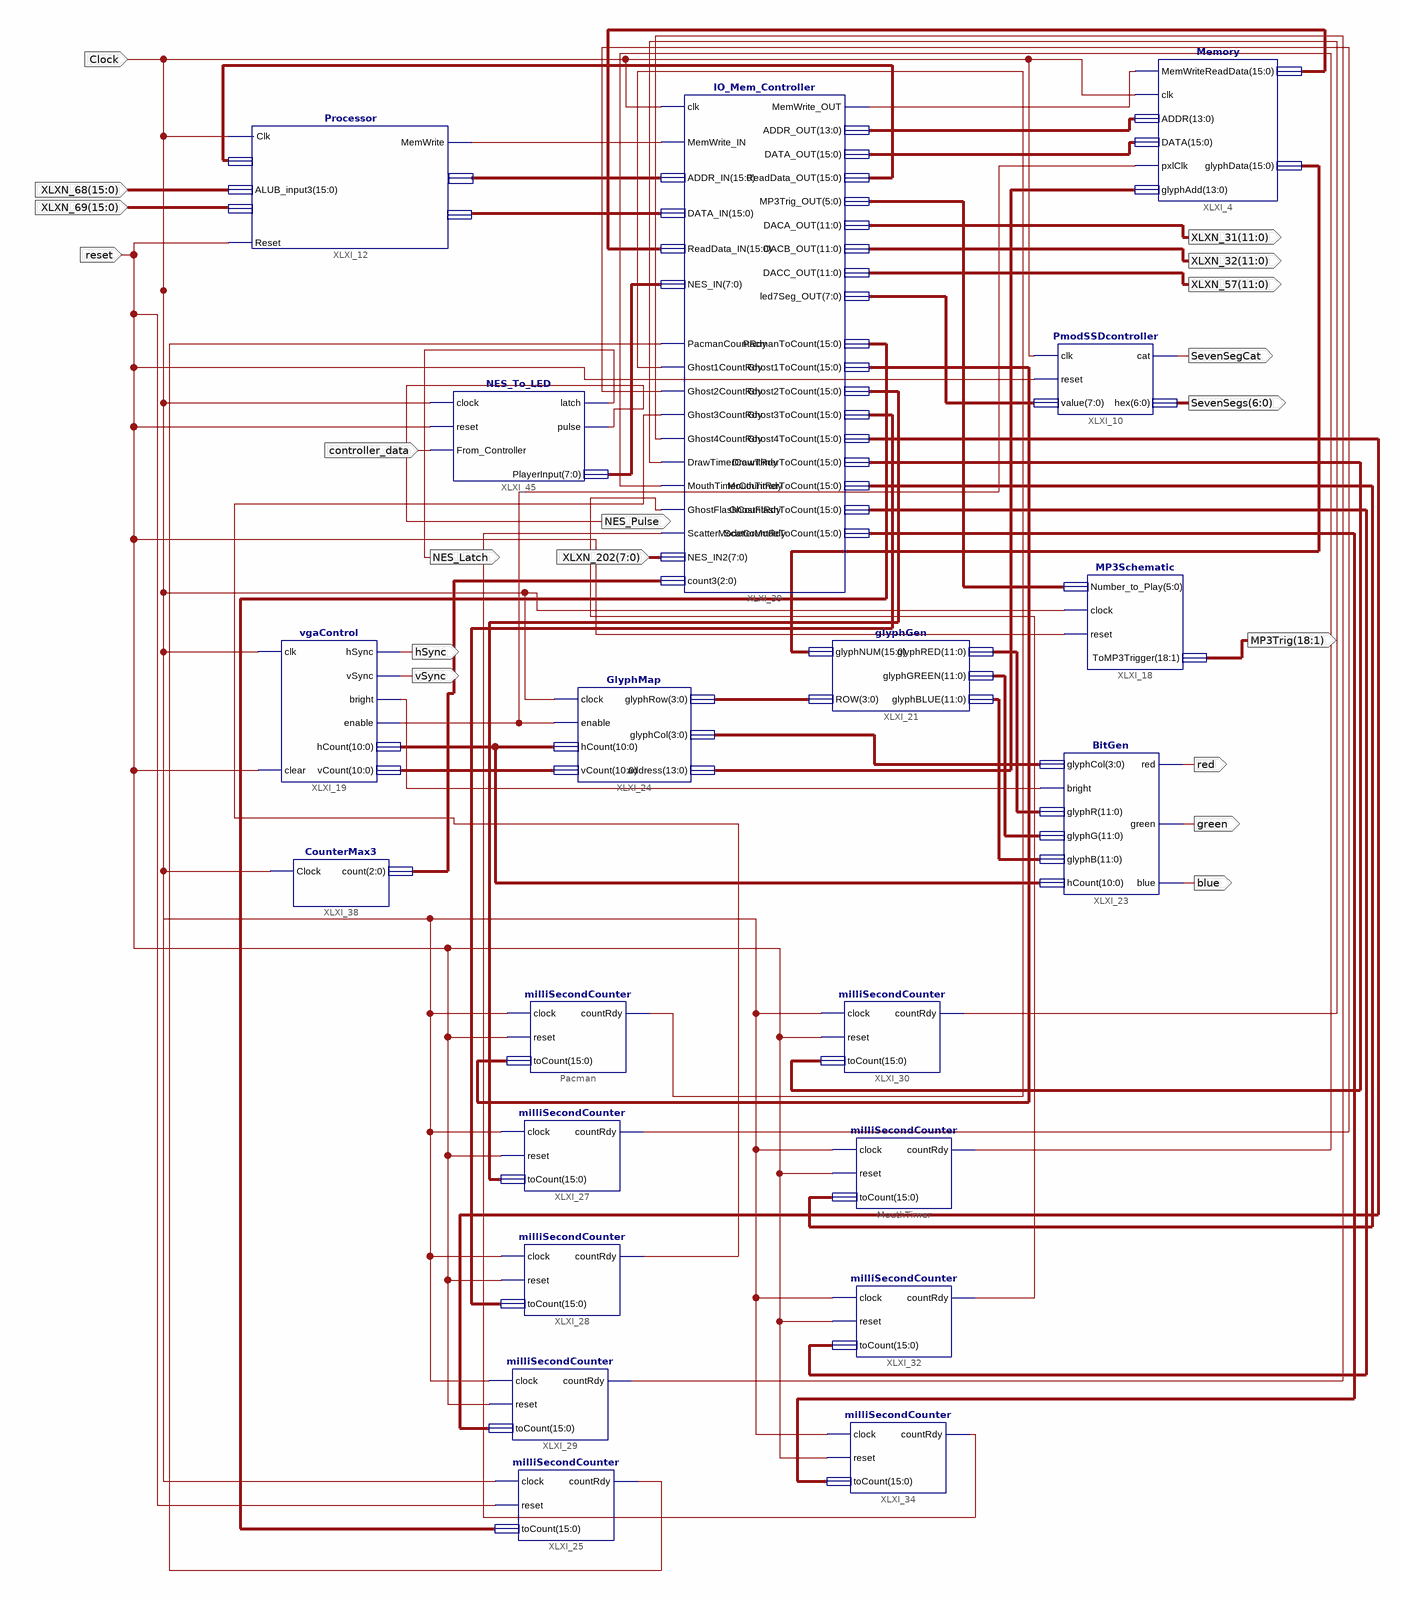
[diagram p0: schematic sheet 1]
// Xilinx ISE schematic Asteroid_System.sch (spartan3e) as structural Verilog: 20 symbols, 19 ports
module Asteroid_System (
  input  Clock,
  input  [15:0] XLXN_68,
  input  [15:0] XLXN_69,
  input  reset,
  input  [7:0] XLXN_202,
  input  controller_data,
  output [11:0] XLXN_31,
  output [11:0] XLXN_32,
  output NES_Latch,
  output NES_Pulse,
  output SevenSegCat,
  output [6:0] SevenSegs,
  output [11:0] XLXN_57,
  output [18:1] MP3Trig,
  output hSync,
  output vSync,
  output red,
  output green,
  output blue
);

  wire XLXN_10, XLXN_65, XLXN_99, XLXN_102, XLXN_152, XLXN_153, XLXN_157, XLXN_159, XLXN_160, XLXN_161,
       XLXN_162, XLXN_189, XLXN_191;
  wire [2:0] XLXN_197;
  wire [3:0] XLXN_111, XLXN_116;
  wire [5:0] XLXN_192;
  wire [7:0] XLXN_55, XLXN_205;
  wire [10:0] XLXN_135, XLXN_136;
  wire [11:0] XLXN_94, XLXN_95, XLXN_96;
  wire [13:0] XLXN_58, XLXN_109;
  wire [15:0] XLXN_59, XLXN_62, XLXN_63, XLXN_66, XLXN_118, XLXN_146, XLXN_151, XLXN_164, XLXN_165, XLXN_166,
       XLXN_167, XLXN_168, XLXN_169, XLXN_170, XLXN_193;

  Memory XLXI_4 (
    .MemWrite(XLXN_10), .clk(Clock), .pxlClk(XLXN_99), .ADDR(XLXN_58), .DATA(XLXN_59), .glyphAdd(XLXN_109),
    .ReadData(XLXN_146), .glyphData(XLXN_118));
  PmodSSDcontroller XLXI_10 (.clk(Clock), .reset(reset), .value(XLXN_55), .cat(SevenSegCat), .hex(SevenSegs));
  Processor XLXI_12 (
    .Clk(Clock), .Reset(reset), .ReadData(XLXN_66), .ALUB_input3(XLXN_68), .PCSource3(XLXN_69),
    .MemWrite(XLXN_65), .Address(XLXN_62), .Data(XLXN_63));
  MP3Schematic XLXI_18 (.Number_to_Play(XLXN_192), .clock(Clock), .reset(reset), .ToMP3Trigger(MP3Trig));
  vgaControl XLXI_19 (
    .clk(Clock), .clear(reset), .hSync(hSync), .vSync(vSync), .bright(XLXN_102), .enable(XLXN_99),
    .hCount(XLXN_136), .vCount(XLXN_135));
  glyphGen XLXI_21 (.glyphNUM(XLXN_118), .ROW(XLXN_111), .glyphRED(XLXN_94), .glyphGREEN(XLXN_95), .glyphBLUE(XLXN_96));
  BitGen XLXI_23 (
    .bright(XLXN_102), .glyphR(XLXN_94), .glyphG(XLXN_95), .glyphB(XLXN_96), .hCount(XLXN_136), .red(red),
    .green(green), .blue(blue), .glyphCol(XLXN_116));
  GlyphMap XLXI_24 (
    .clock(Clock), .enable(XLXN_99), .hCount(XLXN_136), .vCount(XLXN_135), .glyphRow(XLXN_111),
    .glyphCol(XLXN_116), .address(XLXN_109));
  milliSecondCounter XLXI_25 (.clock(Clock), .reset(reset), .toCount(XLXN_193), .countRdy(XLXN_191));
  milliSecondCounter Pacman (.clock(Clock), .reset(reset), .toCount(XLXN_151), .countRdy(XLXN_152));
  milliSecondCounter XLXI_27 (.clock(Clock), .reset(reset), .toCount(XLXN_164), .countRdy(XLXN_153));
  milliSecondCounter XLXI_28 (.clock(Clock), .reset(reset), .toCount(XLXN_165), .countRdy(XLXN_157));
  milliSecondCounter XLXI_29 (.clock(Clock), .reset(reset), .toCount(XLXN_166), .countRdy(XLXN_189));
  milliSecondCounter XLXI_30 (.clock(Clock), .reset(reset), .toCount(XLXN_167), .countRdy(XLXN_159));
  milliSecondCounter MouthTimer (.clock(Clock), .reset(reset), .toCount(XLXN_168), .countRdy(XLXN_160));
  milliSecondCounter XLXI_32 (.clock(Clock), .reset(reset), .toCount(XLXN_169), .countRdy(XLXN_161));
  milliSecondCounter XLXI_34 (.clock(Clock), .reset(reset), .toCount(XLXN_170), .countRdy(XLXN_162));
  CounterMax3 XLXI_38 (.Clock(Clock), .count(XLXN_197));
  IO_Mem_Controller XLXI_39 (
    .clk(Clock), .MemWrite_IN(XLXN_65), .PacmanCountRdy(XLXN_191), .Ghost1CountRdy(XLXN_152),
    .Ghost2CountRdy(XLXN_153), .Ghost3CountRdy(XLXN_157), .Ghost4CountRdy(XLXN_189),
    .DrawTimerCountRdy(XLXN_159), .MouthTimerCountRdy(XLXN_160), .GhostFlashCountRdy(XLXN_161),
    .ScatterModeCountRdy(XLXN_162), .ADDR_IN(XLXN_62), .DATA_IN(XLXN_63), .ReadData_IN(XLXN_146),
    .NES_IN(XLXN_205), .NES_IN2(XLXN_202), .MemWrite_OUT(XLXN_10), .ADDR_OUT(XLXN_58), .DATA_OUT(XLXN_59),
    .ReadData_OUT(XLXN_66), .PacmanToCount(XLXN_193), .Ghost1ToCount(XLXN_151), .Ghost2ToCount(XLXN_164),
    .Ghost3ToCount(XLXN_165), .Ghost4ToCount(XLXN_166), .DrawTimerToCount(XLXN_167),
    .MouthTimerToCount(XLXN_168), .GhostFlashToCount(XLXN_169), .ScatterModeToCount(XLXN_170),
    .MP3Trig_OUT(XLXN_192), .DACA_OUT(XLXN_31), .DACB_OUT(XLXN_32), .DACC_OUT(XLXN_57),
    .led7Seg_OUT(XLXN_55), .count3(XLXN_197));
  NES_To_LED XLXI_45 (
    .clock(Clock), .reset(reset), .From_Controller(controller_data), .latch(NES_Latch), .pulse(NES_Pulse),
    .PlayerInput(XLXN_205));
endmodule
